# EAGLE design takiuino-m18-smashed-routed (EAGLE 7.2.0)
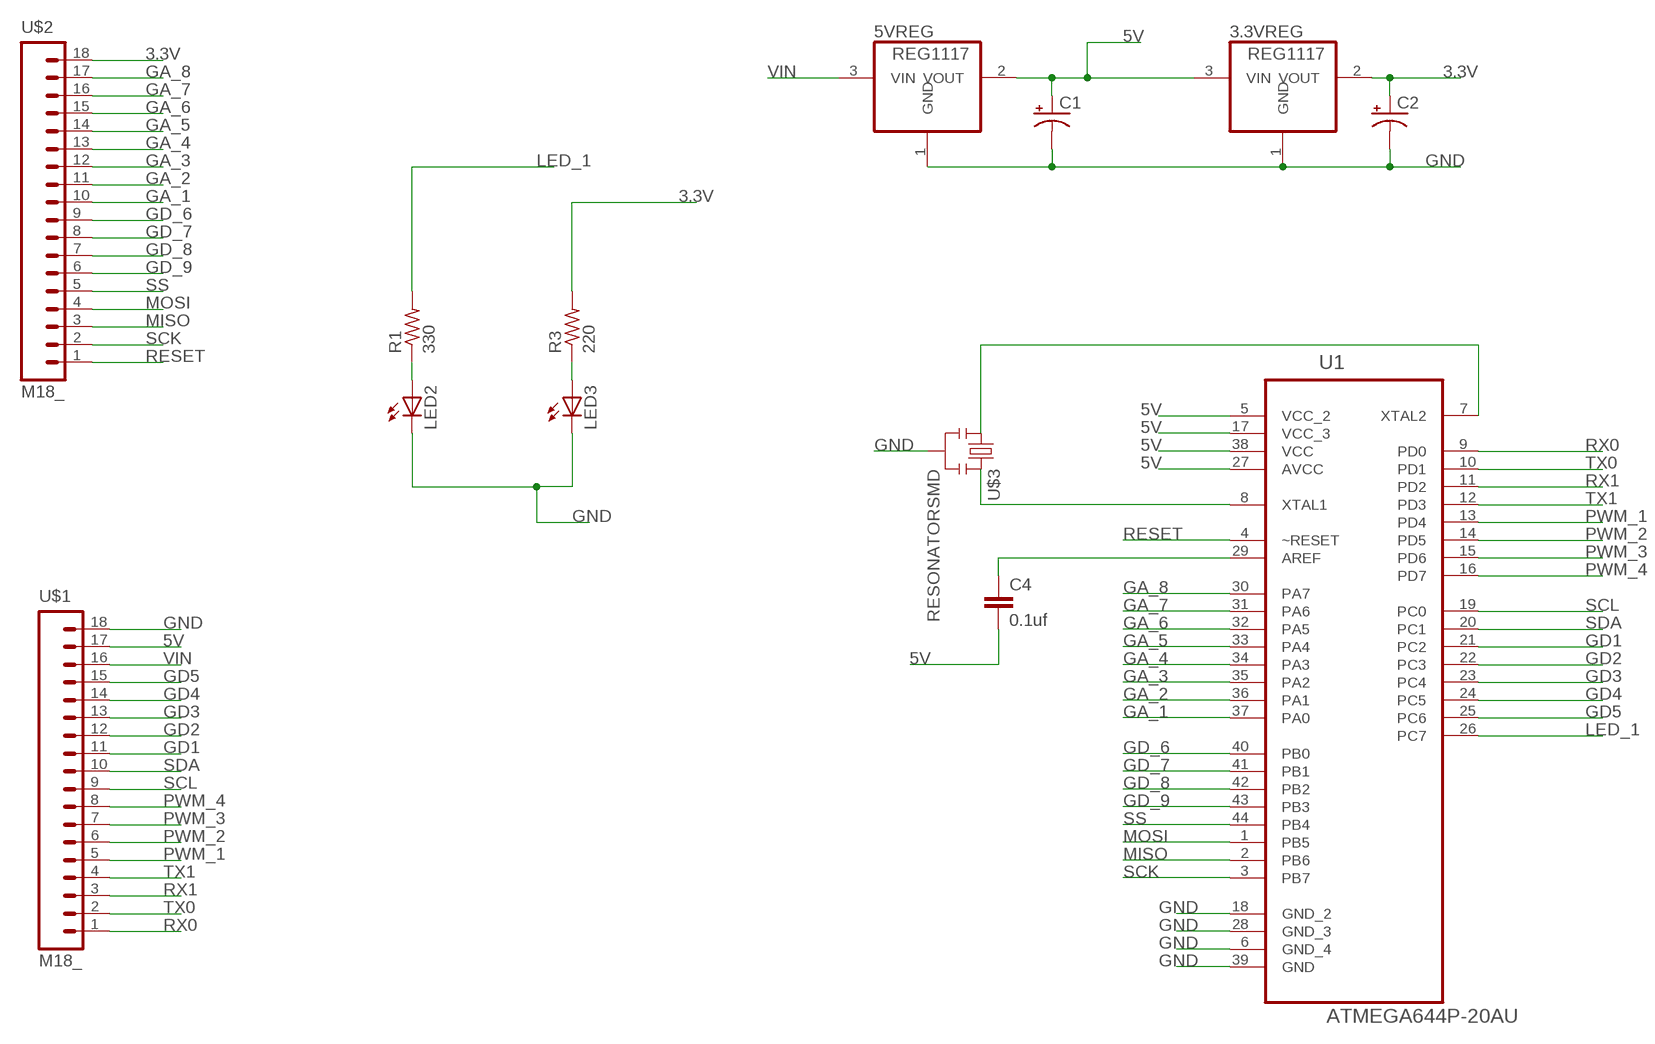
[diagram p0: schematic, sheet 1]

## Parts
3.3VREG  REG1117  [SOT223]
5VREG  REG1117  [SOT223]
C1  CAP_POL1206  [EIA3216]
C2  CAP_POL1206  [EIA3216]
C4  0.1uf  CAP0603-CAP  [0603-CAP]
LED2  LEDCHIP-LED0603  [CHIP-LED0603]
LED3  LEDCHIP-LED0603  [CHIP-LED0603]
R1  330  R-US_R0603  [R0603]
R3  220  R-US_R0603  [R0603]
U1  ATMEGA644P-20AU  [QFP80P1200X1200X120-44N]
U$1  M18_  [1X18]
U$2  M18_  [1X18]
U$3  RESONATORSMD  [RESONATOR-SMD]

## Nets
3.3V: 3.3VREG.2(VOUT) C2.A(+) R3.2 U$2.18
5V: 3.3VREG.3(VIN) 5VREG.2(VOUT) C1.A(+) C4.2 U1.5(VCC_2) U1.17(VCC_3) U1.27(AVCC) U1.38(VCC) U$1.17
GA_1: U1.37(PA0) U$2.10
GA_2: U1.36(PA1) U$2.11
GA_3: U1.35(PA2) U$2.12
GA_4: U1.34(PA3) U$2.13
GA_5: U1.33(PA4) U$2.14
GA_6: U1.32(PA5) U$2.15
GA_7: U1.31(PA6) U$2.16
GA_8: U1.30(PA7) U$2.17
GD1: U1.21(PC2) U$1.11
GD2: U1.22(PC3) U$1.12
GD3: U1.23(PC4) U$1.13
GD4: U1.24(PC5) U$1.14
GD5: U1.25(PC6) U$1.15
GD_6: U1.40(PB0) U$2.9
GD_7: U1.41(PB1) U$2.8
GD_8: U1.42(PB2) U$2.7
GD_9: U1.43(PB3) U$2.6
GND: 3.3VREG.1(GND) 5VREG.1(GND) C1.C(-) C2.C(-) LED2.C LED3.C U1.6(GND_4) U1.18(GND_2) U1.28(GND_3) U1.39(GND) U$1.18 U$3.2
LED_1: R1.2 U1.26(PC7)
MISO: U1.2(PB6) U$2.3
MOSI: U1.1(PB5) U$2.4
N$1: U1.8(XTAL1) U$3.3
N$2: U1.7(XTAL2) U$3.1
N$3: C4.1 U1.29(AREF)
N$4: LED2.A R1.1
N$6: LED3.A R3.1
PWM_1: U1.13(PD4) U$1.5
PWM_2: U1.14(PD5) U$1.6
PWM_3: U1.15(PD6) U$1.7
PWM_4: U1.16(PD7) U$1.8
RESET: U1.4(~RESET) U$2.1
RX0: U1.9(PD0) U$1.1
RX1: U1.11(PD2) U$1.3
SCK: U1.3(PB7) U$2.2
SCL: U1.19(PC0) U$1.9
SDA: U1.20(PC1) U$1.10
SS: U1.44(PB4) U$2.5
TX0: U1.10(PD1) U$1.2
TX1: U1.12(PD3) U$1.4
VIN: 5VREG.3(VIN) U$1.16

## Library data of the parts
3.3VREG 5VREG = burr-brown:REG1117: 800mA and 1A Low Dropout (LDO) Positive Regulator 1.8V, 2.5V, 2.85V, 3.3V, 5V, and Adj; MPN: REG1117; OC_FARNELL: 1097566; OC_NEWARK: 14P6981
C1 C2 = SparkFun-Passives:CAP_POL: Capacitor Polarized These are standard SMD and PTH capacitors. Normally 10uF, 47uF, and 100uF in electrolytic and tantalum varieties. Always verify the external diameter of the through hole cap, it varies with capacity, voltage, and manufacturer. The EIA devices should be standard.
C4 = SparkFun-Capacitors:CAP: Capacitor Standard 0603 ceramic capacitor, and 0.1" leaded capacitor.
LED2 LED3 = led:LED: LED OSRAM: - CHIPLED LG R971, LG N971, LY N971, LG Q971, LY Q971, LO R971, LY R971 LH N974, LH R974 LS Q976, LO Q976, LY Q976 LO Q996 - Hyper CHIPLED LW Q18S LB Q993, LB Q99A, LB R99A - SideLED LS A670, LO A670, LY A670, LG A670, LP A670 LB A673, LV A673, LT A673, LW A673 LH A674 LY A675 LS A676, LA A676, LO A676, LY A676, LW A676 LS A679, LY A679, LG A679 - Hyper Micro SIDELED® LS Y876, LA Y876, LO Y876, LY Y876 LT Y87S - SmartLED LW L88C, LW L88S LB L89C, LB L89S, LG L890 LS L89K, LO L89K, LY L89K LS L896, LA L896, LO L896, LY L896 - TOPLED LS T670, LO T670, LY T670, LG T670, LP T670 LSG T670, LSP T670, LSY T670, LOP T670, LYG T670 LG T671, LOG T671, LSG T671 LB T673, LV T673, LT T673, LW T673 LH T674 LS T676, LA T676, LO T676, LY T676, LB T676, LH T676, LSB T676, LW T676 LB T67C, LV T67C, LT T67C, LS T67K, LO T67K, LY T67K, LW E67C LS E67B, LA E67B, LO E67B, LY E67B, LB E67C, LV E67C, LT E67C LW T67C LS T679, LY T679, LG T679 LS T770, LO T770, LY T770, LG T770, LP T770 LB T773, LV T773, LT T773, LW T773 LH T774 LS E675, LA E675, LY E675, LS T675 LS T776, LA T776, LO T776, LY T776, LB T776 LHGB T686 LT T68C, LB T68C - Hyper Mini TOPLED® LB M676 - Mini TOPLED Santana® LG M470 LS M47K, LO M47K, LY M47K Source: http://www.osram.convergy.de LUXEON: - LUMILED® LXK2-PW12-R00, LXK2-PW12-S00, LXK2-PW14-U00, LXK2-PW14-V00 LXK2-PM12-R00, LXK2-PM12-S00, LXK2-PM14-U00 LXK2-PE12-Q00, LXK2-PE12-R00, LXK2-PE12-S00, LXK2-PE14-T00, LXK2-PE14-U00 LXK2-PB12-K00, LXK2-PB12-L00, LXK2-PB12-M00, LXK2-PB14-N00, LXK2-PB14-P00, LXK2-PB14-Q00 LXK2-PR12-L00, LXK2-PR12-M00, LXK2-PR14-Q00, LXK2-PR14-R00 LXK2-PD12-Q00, LXK2-PD12-R00, LXK2-PD12-S00 LXK2-PH12-R00, LXK2-PH12-S00 LXK2-PL12-P00, LXK2-PL12-Q00, LXK2-PL12-R00 Source: www.luxeon.com KINGBRIGHT: KA-3528ASYC Source: www.kingbright.com
R1 R3 = adafruit:R-US_: RESISTOR, American symbol
U1 = Atmel_By_element14_Batch_1-00:ATMEGA644P-20AU: 8-bit Microcontroller with Bytes In-System Programmable Flash; MPN: ATMEGA644P-20AU; OC_FARNELL: 1455121; OC_NEWARK: 58M3746; PACKAGE: TQFP-44; SUPPLIER: Atmel
U$1 U$2 = SparkFun-Connectors:M18: 1x18 .1" header
U$3 = SparkFun:RESONATOR: Resonator Small SMD resonator. This is the itty bitty 10/20MHz resonators with built in caps. CSTCE10M0G55 and CSTCE20M0V53. Footprint has been reviewed closely but hasn't been tested yet.

## Net classes
0 default: width 0.406 mm, clearance 0.152 mm
1 hi: width 0.813 mm, clearance 0.152 mm

## Board
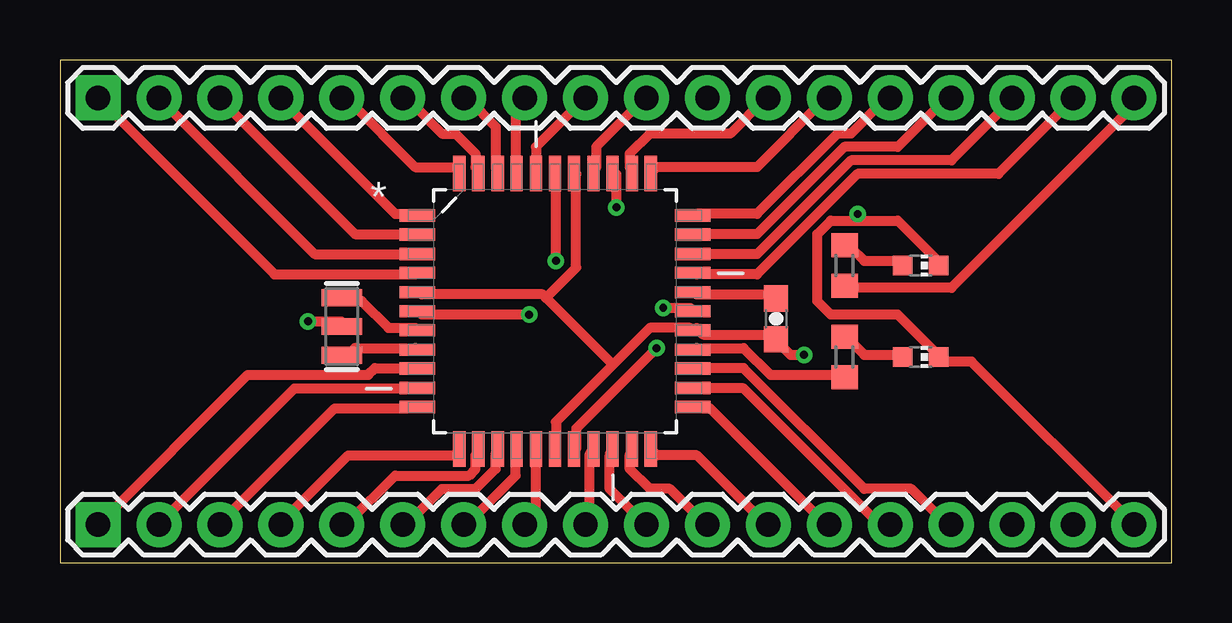
[diagram p1: board, top side]
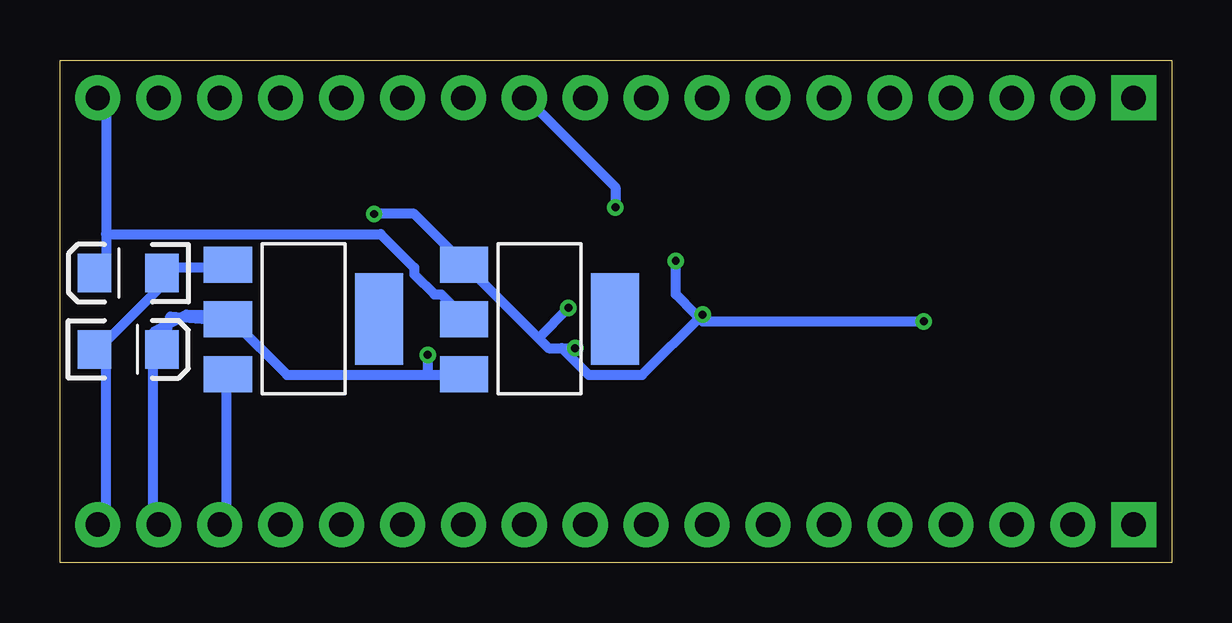
[diagram p2: board, bottom side, seen from below]

Size 46.34 x 20.95 mm. Coordinates in mm from the lower left corner, seen from the top.
Outline: 0,0 46.34,0 46.34,20.95 0,20.95 0,0
Copper layers (1*16): Top 0.0356mm / dielectric 1.5011mm / Bottom 0.0356mm
Design rules "LaenPCBOrder": minimum track width 6mil, minimum drill 13mil, track to track 6mil, track to pad 6mil, pad to pad 6mil, via to via 6mil, smd to smd 6mil, copper to edge 15mil, drill to drill 6mil, minimum pad ring 7mil, minimum via ring 7mil, stop-mask expansion 3mil, vias tented up to drill 0mil, thermal gap 10mil

### Footprints (pad centres in the part's own frame; a part is rotated, then mirrored left to right if it is on the bottom)
SOT223 = smd 1.499 x 2.007: 1 -2.261,-3.15; 2 0.025,-3.15; 3 2.311,-3.15 | smd 3.81 x 2.007: 4 0,3.15
EIA3216 = smd 1.4 x 1.6: A 1.4,0; C -1.4,0
0603-CAP = smd 1.1 x 1: 1 -0.85,0; 2 0.85,0
CHIP-LED0603 = smd 0.8 x 0.8: A 0,-0.75; C 0,0.75
R0603 = smd 1 x 1.1: 1 -0.85,0; 2 0.85,0
QFP80P1200X1200X120-44N = smd 1.473 x 0.508: 1 -5.74,3.988; 2 -5.74,3.2; 3 -5.74,2.388; 4 -5.74,1.6; 5 -5.74,0.787; 6 -5.74,0; 7 -5.74,-0.787; 8 -5.74,-1.6; 9 -5.74,-2.388; 10 -5.74,-3.2; 11 -5.74,-3.988; 23 5.74,-3.988; 24 5.74,-3.2; 25 5.74,-2.388; 26 5.74,-1.6; 27 5.74,-0.787; 28 5.74,0; 29 5.74,0.787; 30 5.74,1.6; 31 5.74,2.388; 32 5.74,3.2; 33 5.74,3.988 | smd 0.508 x 1.473: 12 -3.988,-5.74; 13 -3.2,-5.74; 14 -2.388,-5.74; 15 -1.6,-5.74; 16 -0.787,-5.74; 17 0,-5.74; 18 0.787,-5.74; 19 1.6,-5.74; 20 2.388,-5.74; 21 3.2,-5.74; 22 3.988,-5.74; 34 3.988,5.74; 35 3.2,5.74; 36 2.388,5.74; 37 1.6,5.74; 38 0.787,5.74; 39 0,5.74; 40 -0.787,5.74; 41 -1.6,5.74; 42 -2.388,5.74; 43 -3.2,5.74; 44 -3.988,5.74
1X18 = drill 1.016 pad 1.88 square: 1 0,0 | drill 1.016 pad 1.88: 2 2.54,0; 3 5.08,0; 4 7.62,0; 5 10.16,0; 6 12.7,0; 7 15.24,0; 8 17.78,0; 9 20.32,0; 10 22.86,0; 11 25.4,0; 12 27.94,0; 13 30.48,0; 14 33.02,0; 15 35.56,0; 16 38.1,0; 17 40.64,0; 18 43.18,0
RESONATOR-SMD = smd 0.7 x 1.7: 1 -1.2,0; 2 0,0; 3 1.2,0

### Placement (x,y rotation side)
3.3VREG  26.35,10.16 270 bottom
5VREG  36.2,10.16 270 bottom
C1  43.5,8.89 0 bottom
C2  43.5,12.06 180 bottom
C4  29.84,10.16 270 top
LED2  35.88,8.57 270 top
LED3  35.88,12.38 270 top
R1  32.7,8.57 270 top
R3  32.7,12.38 270 top
U1  20.64,10.48 0 top
U$1  1.59,1.59 0 top
U$2  1.59,19.37 0 top
U$3  11.75,9.84 270 top

### Tracks (layer width: path | path; a pad name or v marks a point on that pad's centre or on a via)
3.3V
  Top 0.406: R3.2 32.97,11.46 37.16,11.46 44.98,19.28 U$2.18
  Bottom 0.406: 44.42,13.69 44.42,19 44.7,19.28 U$2.18 | 44.42,13.69 44.42,12.29 44.7,12.29 C2.A | 44.42,13.69 32.97,13.69 31.57,12.29 31.57,12.01 30.73,11.18 30.45,11.18 29.62,10.34 3.3VREG.2
5V  (via drill 0.33)
  Top 0.406: 23.05,8.24 24.59,9.78 26.26,9.78 U1.27 26.54,9.78 26.82,9.5 29.62,9.5 C4.2 29.9,9.22 30.45,8.66 v31.01,8.66 | 23.05,8.24 20.68,5.87 20.68,4.75 U1.17 | 23.05,8.24 20.26,11.04 | 20.26,11.04 20.12,11.18 15.09,11.18 U1.5 | 20.26,11.04 21.51,12.29 21.51,16.2 U1.38
  Bottom 0.406: 42.19,8.66 41.74,10.25 39.4,10.06 5VREG.2 | 42.19,8.66 42.47,8.66 | 31.01,7.82 36.88,7.82 39.12,10.06 5VREG.2 | 31.01,7.82 29.62,7.82 3.3VREG.3 | U$1.17 42.47,1.68 42.47,8.38 42.43,9.61 41.07,10.34 39.4,10.34 5VREG.2 | v31.01,8.66 31.01,7.82 | 42.19,8.66 C1.A
GA_1
  Top 0.406: U1.37 22.35,16.48 22.35,17.32 24.31,19.28 U$2.10
GA_2  (via drill 0.33)
  Top 0.406: v23.19,14.81 23.19,16.2 U1.36
  Bottom 0.406: v23.19,14.81 23.19,15.65 26.82,19.28 U$2.11
GA_3
  Top 0.406: U1.35 23.75,16.48 23.75,17.04 24.59,17.88 27.94,17.88 29.34,19.28 U$2.12
GA_4
  Top 0.406: U1.34 24.87,16.48 29.06,16.48 31.85,19.28 U$2.13
GA_5
  Top 0.406: U1.33 26.54,14.53 29.06,14.53 32.41,17.88 32.97,17.88 34.37,19.28 U$2.14
GA_6
  Top 0.406: U1.32 26.54,13.69 29.06,13.69 32.69,17.32 34.92,17.32 36.88,19.28 U$2.15
GA_7
  Top 0.406: U1.31 26.54,12.85 29.06,12.85 32.97,16.76 37.16,16.76 39.67,19.28 U$2.16
GA_8
  Top 0.406: U1.30 26.54,12.01 29.06,12.01 33.25,16.2 39.12,16.2 42.19,19.28 U$2.17
GD1
  Top 0.406: U1.21 23.75,4.47 23.75,3.91 24.59,3.07 25.43,3.07 26.82,1.68 U$1.11
GD2
  Top 0.406: U1.22 24.87,4.47 26.54,4.47 29.34,1.68 U$1.12
GD3
  Top 0.406: U1.23 26.54,6.43 27.1,6.43 31.85,1.68 U$1.13
GD4
  Top 0.406: U1.24 26.54,7.26 28.5,7.26 34.37,1.4 U$1.14
GD5
  Top 0.406: U1.25 26.54,8.1 28.5,8.1 33.53,3.07 35.48,3.07 36.88,1.68 U$1.15
GD_6
  Top 0.406: U1.40 19.84,16.48 19.84,17.32 21.79,19.28 U$2.9
GD_7
  Top 0.406: U$2.8 19,19 19,16.48 U1.41
GD_8
  Top 0.406: U1.42 18.16,16.48 18.16,18.16 17.04,19.28 U$2.7
GD_9
  Top 0.406: U1.43 17.32,16.48 17.32,17.04 16.48,17.88 15.93,17.88 14.53,19.28 U$2.6
GND  (via drill 0.33)
  Top 0.406: U$1.18 44.7,1.68 38,8.38 36.88,8.38 LED2.C 36.6,8.66 34.92,10.34 32.13,10.34 31.57,10.9 31.57,13.69 32.13,14.25 33.53,14.25 | 33.53,14.25 34.92,14.25 36.6,12.57 LED3.C | v24.87,8.94 21.51,5.59 21.51,4.75 U1.18 | v19.56,10.34 15.09,10.34 U1.6 | v25.15,10.62 26.26,10.62 U1.28 | v20.68,12.57 20.68,16.2 U1.39 | v10.34,10.06 11.73,10.06 U$3.2 | v33.25,14.53 33.53,14.25
  Bottom 0.406: 42.19,12.29 39.4,12.29 5VREG.1 | 42.19,12.29 42.47,12.29 | U$1.18 44.7,1.68 44.42,1.96 44.42,8.38 44.7,8.66 C1.C 44.7,8.94 42.19,11.46 42.19,12.01 C2.C 42.19,12.29 | 25.43,8.94 25.98,8.94 26.4,9.36 | 25.43,8.94 v24.87,8.94 | 26.4,9.36 29.34,12.29 3.3VREG.1 29.62,12.57 31.57,14.53 v33.25,14.53 | v19.56,10.34 22.07,7.82 24.31,7.82 25.43,8.94 | 26.4,9.36 v25.15,10.62 | v20.68,12.57 20.68,11.18 19.84,10.34 v19.56,10.34 | v10.34,10.06 19.56,10.06 v19.56,10.34
LED_1
  Top 0.406: R1.2 32.69,7.82 29.62,7.82 28.5,8.94 26.54,8.94 U1.26
MISO
  Top 0.406: U1.2 14.81,13.69 12.29,13.69 6.71,19.28 U$2.3
MOSI
  Top 0.406: U1.1 14.81,14.53 13.97,14.53 9.22,19.28 U$2.4
N$1
  Top 0.406: U1.8 14.81,8.94 12.29,8.94 12.01,8.66 U$3.3
N$2
  Top 0.406: U1.7 14.81,9.78 13.69,9.78 12.57,10.9 12.01,10.9 U$3.1
N$3
  Top 0.406: C4.1 29.62,11.18 26.54,11.18 U1.29
N$4
  Top 0.406: LED2.A 34.92,8.66 33.53,8.66 32.97,9.22 R1.1
N$6
  Top 0.406: LED3.A 34.92,12.57 33.53,12.57 32.97,13.13 R3.1
PWM_1
  Top 0.406: U1.13 17.32,4.47 17.32,3.91 17.04,3.63 13.97,3.63 12.01,1.68 U$1.5
PWM_2
  Top 0.406: U1.14 18.16,4.47 18.16,3.91 17.32,3.07 15.93,3.07 14.53,1.68 U$1.6
PWM_3
  Top 0.406: U1.15 19,4.47 19,3.63 17.04,1.68 U$1.7
PWM_4
  Top 0.406: U1.16 19.84,4.47 19.84,1.96 19.56,1.68 U$1.8
RESET
  Top 0.406: U$2.1 8.94,12.01 14.81,12.01 U1.4
RX0
  Top 0.406: U$1.1 7.82,7.82 12.85,7.82 13.13,8.1 14.81,8.1 U1.9
RX1
  Top 0.406: U1.11 14.81,6.43 11.46,6.43 6.71,1.68 U$1.3
SCK
  Top 0.406: U1.3 14.81,12.85 10.62,12.85 4.19,19.28 U$2.2
SCL
  Top 0.406: U1.19 22.07,4.47 22.07,1.68 U$1.9
SDA
  Top 0.406: U1.20 22.91,4.47 22.91,3.07 24.31,1.68 U$1.10
SS
  Top 0.406: U1.44 16.48,16.48 14.81,16.48 12.01,19.28 U$2.5
TX0
  Top 0.406: U1.10 14.81,7.26 9.78,7.26 4.19,1.68 U$1.2
TX1
  Top 0.406: U1.12 16.48,4.47 12.01,4.47 9.22,1.68 U$1.4
VIN
  Bottom 0.406: 5VREG.3 39.4,7.82 39.4,1.96 39.67,1.68 U$1.16

### Text on the board
tValues: Power | R3 (220) | CSTCE16M0V53-R0 | 644/1284p-au | C4 (0.1uf) | LED 1 | R1 (330)
bValues: RESET | SCK | MISO | MOSI | SS | GD9 | GD8 | GD7 | GD6 | GA1 | GA2 | GA3 | GA4 | GA5 | GA6 | GA7 | GA8 | 3.3V | C2 (10uf) | Takiuino V2.0a | 1117-3.3v | 1117-5v | http://pjr.cc | C1 (10uf) | RX0 | TX0 | RX1 | TX1 | PWM1 | PWM2 | PWM3 | PWM4 | SCL | SDA | GD1 | GD2 | GD3 | GD4 | GD5 | VIN | 5V | GND